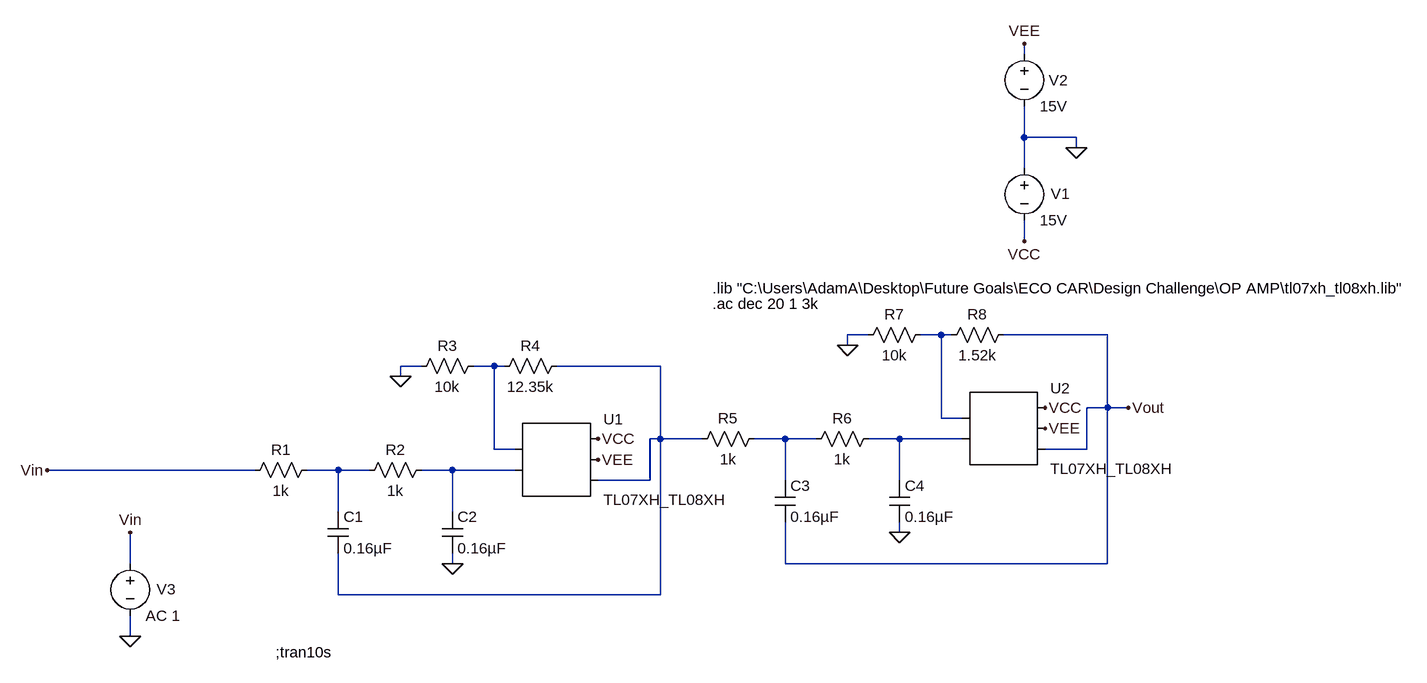
[diagram p0: schematic Design_Challenge - 4th Order Example.asc]
Design_Challenge - 4th Order Example.asc, the LTspice schematic file:
Version 4
SHEET 1 3956 1680
WIRE -256 -176 -256 -192
WIRE -256 -48 -256 -96
WIRE -176 -48 -256 -48
WIRE -176 -32 -176 -48
WIRE -256 0 -256 -48
WIRE -256 112 -256 80
WIRE -496 256 -528 256
WIRE -384 256 -416 256
WIRE -368 256 -384 256
WIRE -128 256 -288 256
WIRE -528 272 -528 256
WIRE -1184 304 -1216 304
WIRE -1072 304 -1104 304
WIRE -1056 304 -1072 304
WIRE -816 304 -976 304
WIRE -1216 320 -1216 304
WIRE -128 368 -128 256
WIRE -128 368 -160 368
WIRE -96 368 -128 368
WIRE -384 384 -384 256
WIRE -352 384 -384 384
WIRE -816 416 -816 304
WIRE -816 416 -832 416
WIRE -752 416 -816 416
WIRE -624 416 -672 416
WIRE -576 416 -624 416
WIRE -448 416 -496 416
WIRE -352 416 -448 416
WIRE -1072 432 -1072 304
WIRE -1040 432 -1072 432
WIRE -160 432 -160 368
WIRE -160 432 -224 432
WIRE -1440 464 -1760 464
WIRE -1312 464 -1360 464
WIRE -1264 464 -1312 464
WIRE -1136 464 -1184 464
WIRE -1040 464 -1136 464
WIRE -832 480 -832 416
WIRE -832 480 -912 480
WIRE -624 480 -624 416
WIRE -448 480 -448 416
WIRE -1312 528 -1312 464
WIRE -1136 528 -1136 464
WIRE -448 560 -448 544
WIRE -1632 608 -1632 560
WIRE -1136 608 -1136 592
WIRE -624 608 -624 544
WIRE -128 608 -128 368
WIRE -128 608 -624 608
WIRE -1312 656 -1312 592
WIRE -816 656 -816 416
WIRE -816 656 -1312 656
WIRE -1632 720 -1632 688
FLAG -176 -32 0
FLAG -256 -192 VEE
FLAG -912 448 VEE
FLAG -256 112 VCC
FLAG -912 416 VCC
FLAG -1760 464 Vin
FLAG -1216 320 0
FLAG -1136 608 0
FLAG -528 272 0
FLAG -448 560 0
FLAG -1632 720 0
FLAG -1632 560 Vin
FLAG -96 368 Vout
FLAG -224 400 VEE
FLAG -224 368 VCC
DATAFLAG -80 352 ""
SYMBOL voltage -256 -192 R0
WINDOW 0 38 56 Left 2
SYMATTR InstName V2
SYMATTR Value 15V
SYMBOL voltage -256 -16 R0
WINDOW 0 41 55 Left 2
SYMATTR InstName V1
SYMATTR Value 15V
SYMBOL res -1344 448 R90
WINDOW 0 0 56 VBottom 2
WINDOW 3 32 56 VTop 2
SYMATTR InstName R1
SYMATTR Value 1k
SYMBOL res -1168 448 R90
WINDOW 0 0 56 VBottom 2
WINDOW 3 32 56 VTop 2
SYMATTR InstName R2
SYMATTR Value 1k
SYMBOL res -1088 288 R90
WINDOW 0 0 56 VBottom 2
WINDOW 3 32 56 VTop 2
SYMATTR InstName R3
SYMATTR Value 10k
SYMBOL res -960 288 R90
WINDOW 0 0 56 VBottom 2
WINDOW 3 32 56 VTop 2
SYMATTR InstName R4
SYMATTR Value 12.35k
SYMBOL cap -1328 528 R0
SYMATTR InstName C1
SYMATTR Value 0.16µF
SYMBOL cap -1152 528 R0
SYMATTR InstName C2
SYMATTR Value 0.16µF
SYMBOL res -656 400 R90
WINDOW 0 0 56 VBottom 2
WINDOW 3 32 56 VTop 2
SYMATTR InstName R5
SYMATTR Value 1k
SYMBOL res -480 400 R90
WINDOW 0 0 56 VBottom 2
WINDOW 3 32 56 VTop 2
SYMATTR InstName R6
SYMATTR Value 1k
SYMBOL res -400 240 R90
WINDOW 0 0 56 VBottom 2
WINDOW 3 32 56 VTop 2
SYMATTR InstName R7
SYMATTR Value 10k
SYMBOL res -272 240 R90
WINDOW 0 0 56 VBottom 2
WINDOW 3 32 56 VTop 2
SYMATTR InstName R8
SYMATTR Value 1.52k
SYMBOL cap -640 480 R0
SYMATTR InstName C3
SYMATTR Value 0.16µF
SYMBOL cap -464 480 R0
SYMATTR InstName C4
SYMATTR Value 0.16µF
SYMBOL voltage -1632 592 R0
WINDOW 0 41 55 Left 2
SYMATTR InstName V3
SYMATTR Value AC 1
SYMBOL AutoGenerated\\TL07XH_TL08XH -976 448 R0
SYMATTR InstName U1
SYMBOL AutoGenerated\\TL07XH_TL08XH -288 400 R0
SYMATTR InstName U2
TEXT -736 184 Left 2 !.lib "C:\\Users\\AdamA\\Desktop\\Future Goals\\ECO CAR\\Design Challenge\\OP AMP\\tl07xh_tl08xh.lib"
TEXT -736 208 Left 2 !.ac dec 20 1 3k
TEXT -1408 744 Left 2 !;tran10s

The netlist it stands for:
* Design_Challenge - 4th Order Example.asc
V2 VEE 0 15V
V1 0 VCC 15V
R1 N006 Vin 1k
R2 N007 N006 1k
R3 N002 0 10k
R4 N003 N002 12.35k
C1 N006 N003 0.16µF
C2 N007 0 0.16µF
R5 N004 N003 1k
R6 N005 N004 1k
R7 N001 0 10k
R8 Vout N001 1.52k
C3 N004 Vout 0.16µF
C4 N005 0 0.16µF
V3 Vin 0 AC 1
* U1: TL07XH_TL08XH (symbol AutoGenerated\TL07XH_TL08XH not available, pins judged from their places): pin1=N002 pin2=N007 pin3=VCC pin4=VEE pin5=N003
* U2: TL07XH_TL08XH (symbol AutoGenerated\TL07XH_TL08XH not available, pins judged from their places): pin1=N001 pin2=N005 pin3=VCC pin4=VEE pin5=Vout
.lib "C:\Users\AdamA\Desktop\Future Goals\ECO CAR\Design Challenge\OP AMP\tl07xh_tl08xh.lib"
.ac dec 20 1 3k
;tran10s
.backanno
.end